# EasyEDA schematic SCH_d_01_e_03.json
TITLE: Sheet_1; REV: 1.0; Date: 2025-01-14; Sheet: 1/1; Drawn By: artem.v.ulyanov; Company: Your Company
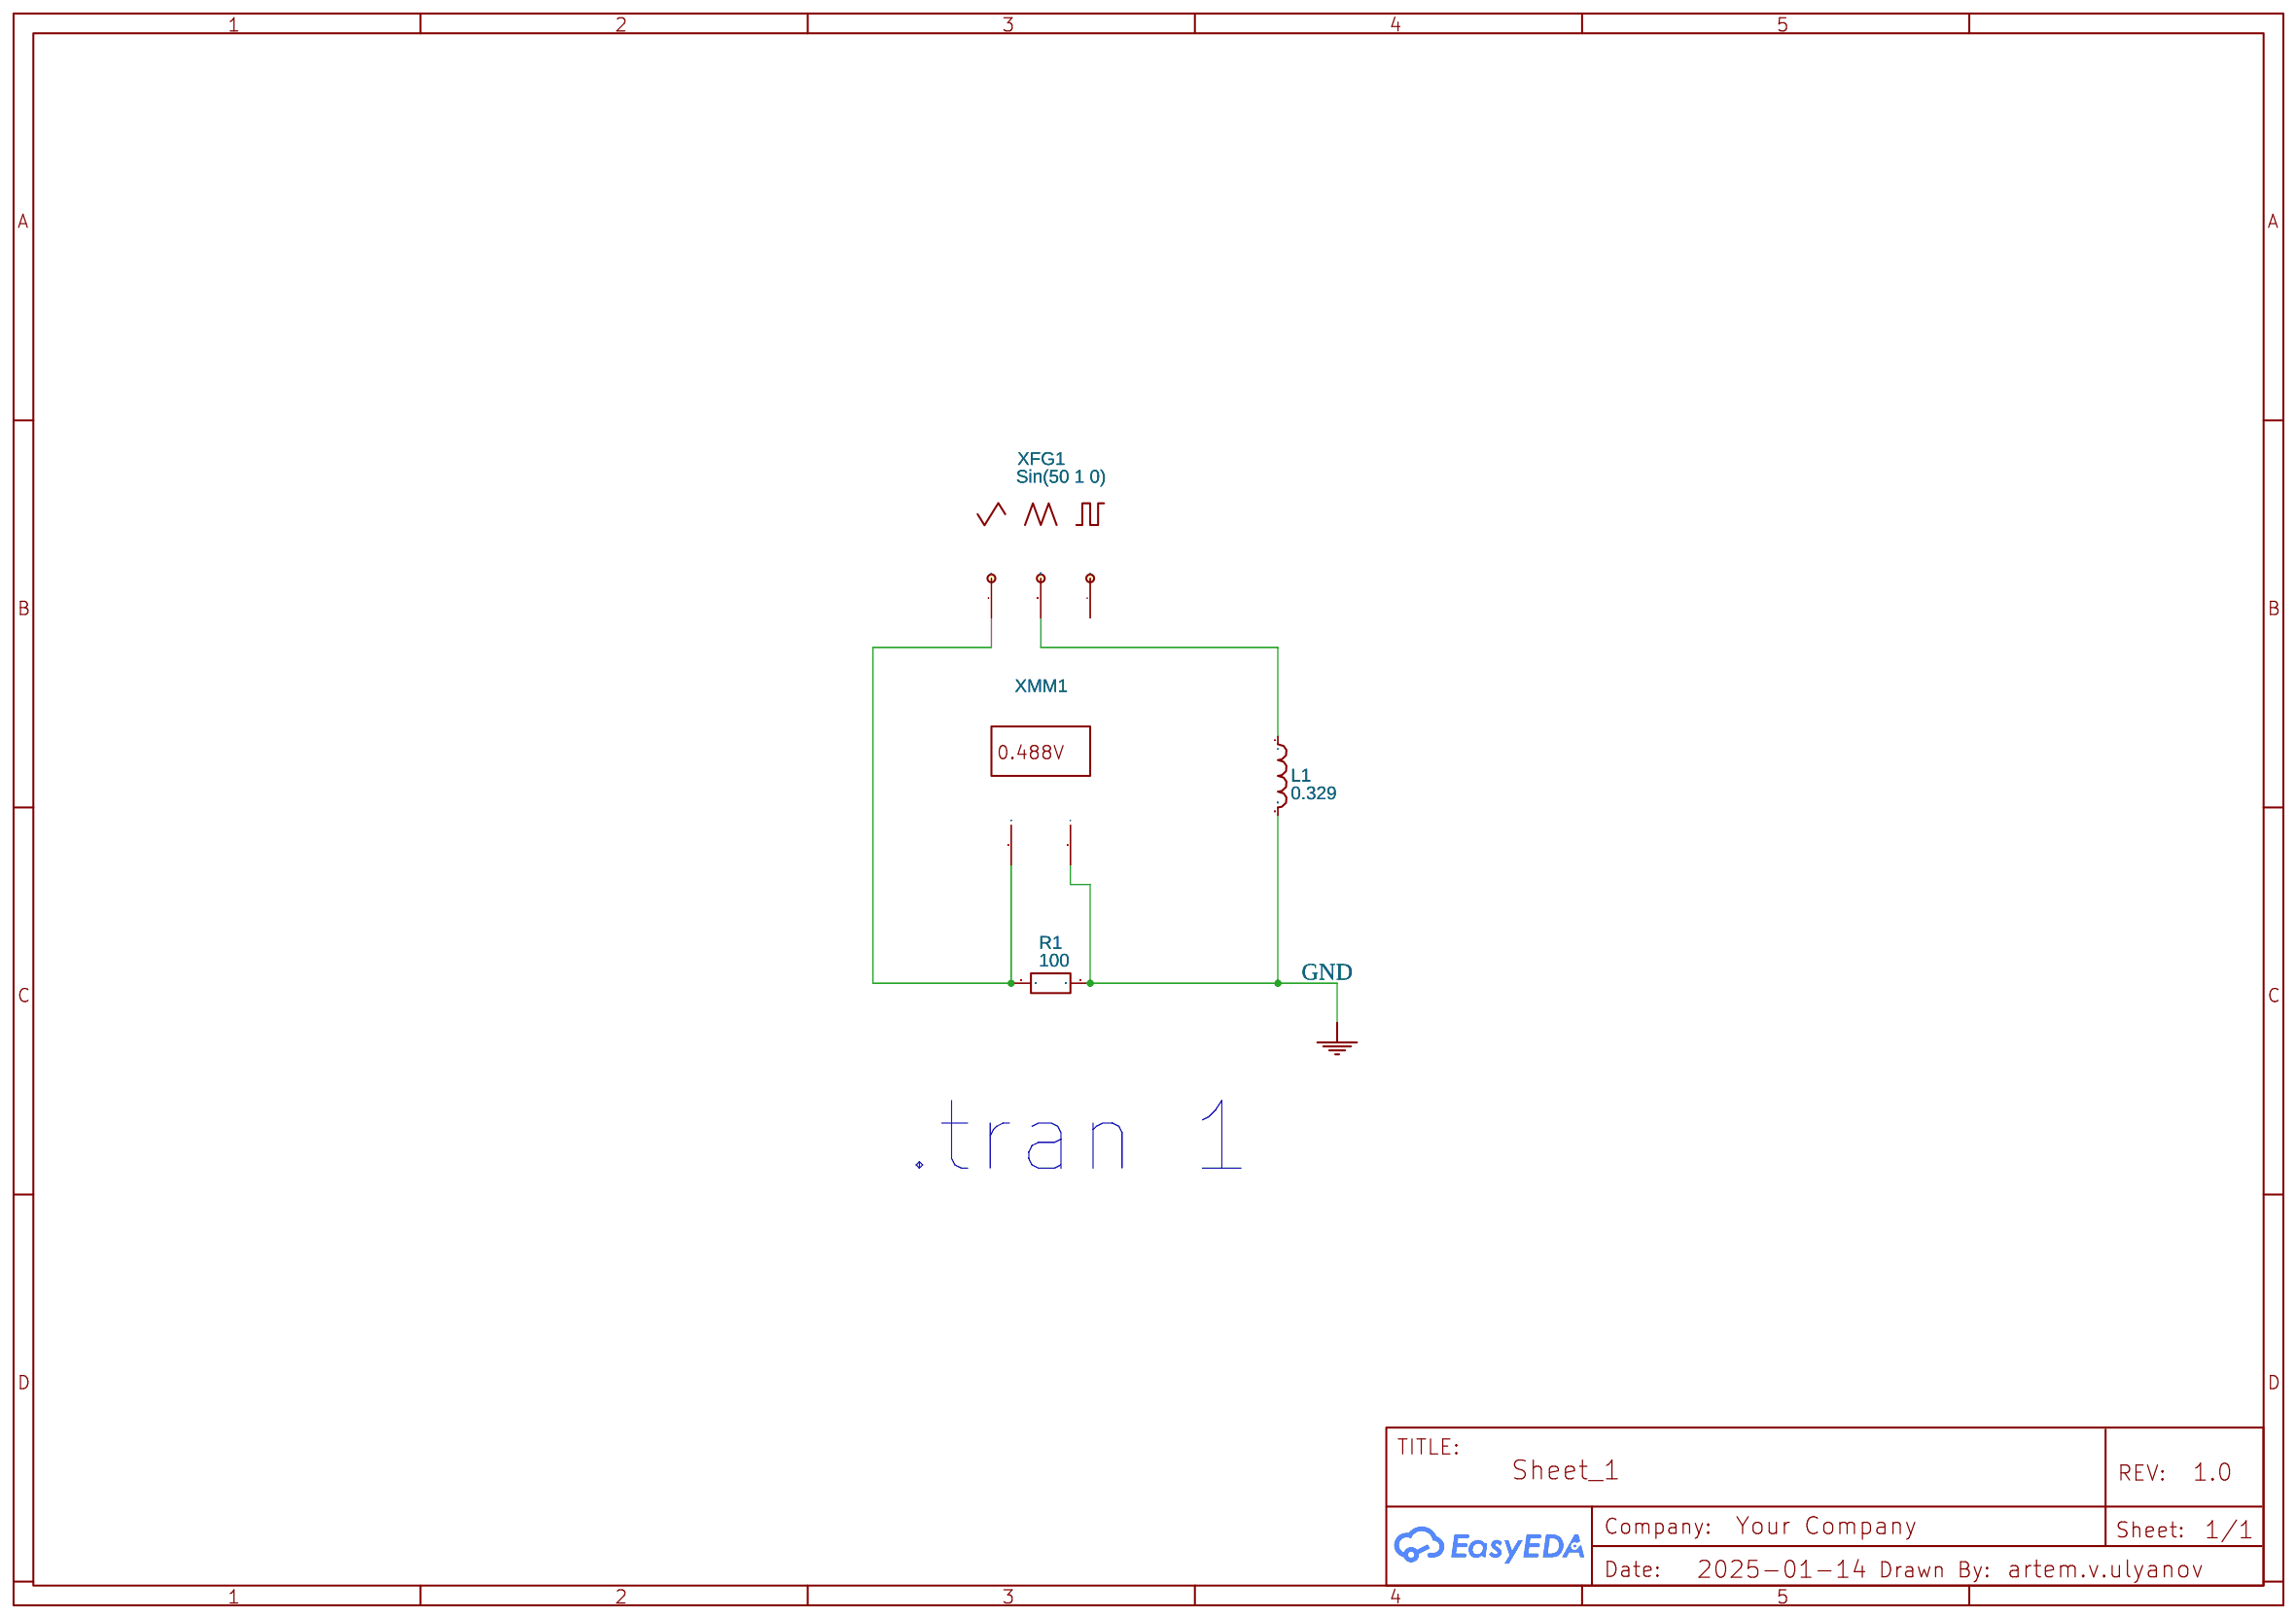
[diagram p0: schematic sheet]

## Parts
L1  0.329  [AXIAL-0.4]
R1  100  [R0603]
XFG1  Sin(50 1 0)
XMM1  Multimeter

## Library data of the parts
L1 = Inductor: Supplier: YUJING; Contributor: EasyEDA; Inductance: 1m
R1 = R_0603_EU: Contributor: LCEDA_Lib
XFG1 = FUNCTIONGENERATOR: Supplier: LCSC; Waveforms: Sine Wave; Frequency: 50; Duty cycle: 50; Amplitude: 1; Offset: 0; Rise/Fall Time: 10; NameDisplay: 1; Contributor: EasyEDA; sim: true
XMM1 = MULTIMETER: Supplier: LCSC; Multimeter Type: Voltmeter; Power Type: AC; Voltmeter resistance: 10μ; Ammeter resistance: 1G; NameDisplay: 0; Contributor: EasyEDA; sim: true

## Nets
GND: L1.2 R1.2 XMM1.2(I)
Net-(L1-1): L1.1 XFG1.COM
Net-(R1-1): R1.1 XFG1.+ XMM1.1(+)

Not connected (* = marked no-connect by the designer): XFG1 -

## Notes on the sheet
- .tran 1
